# EAGLE design Zio Line Finder (EAGLE 8.6.1)
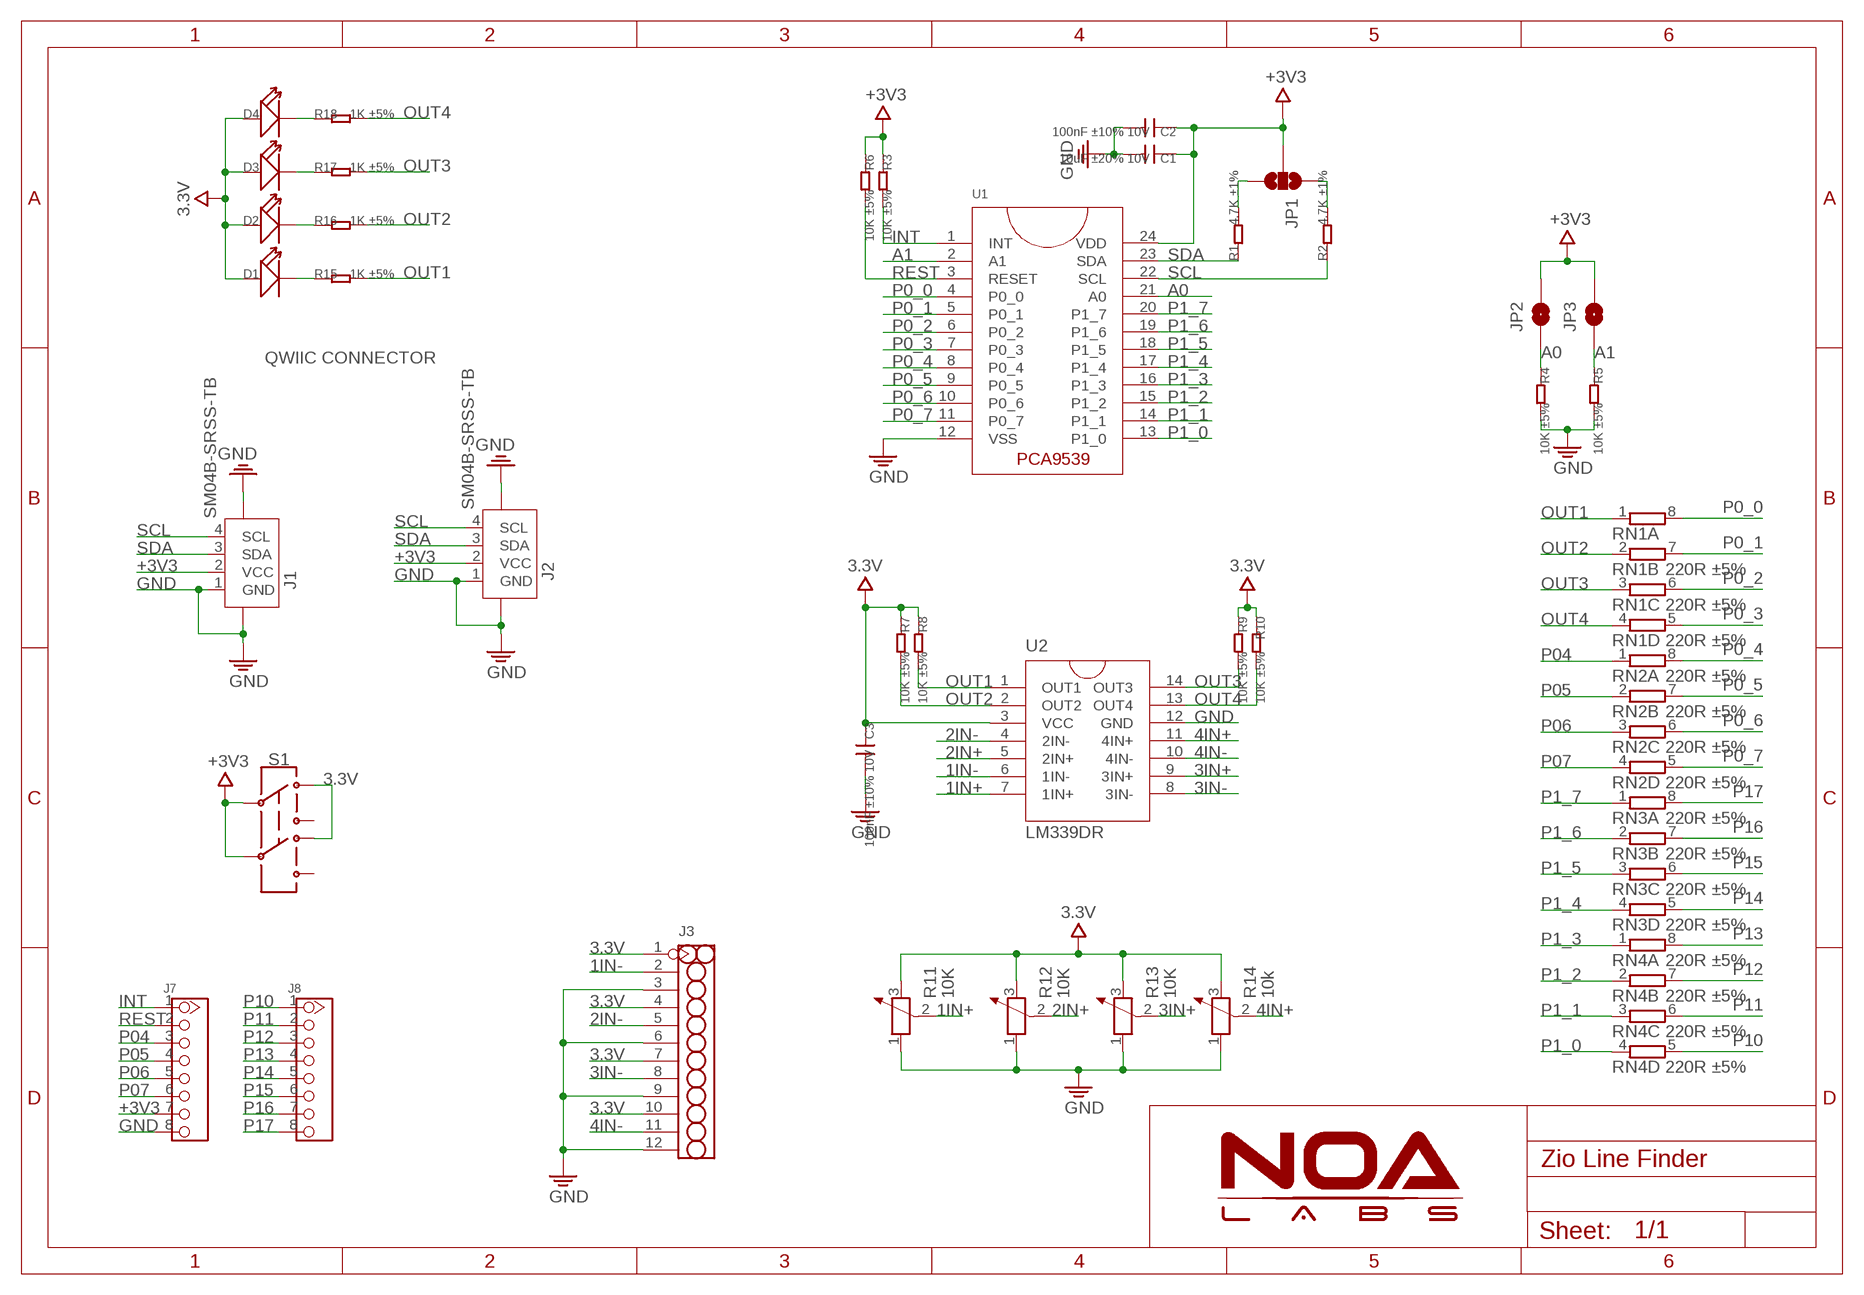
[diagram p0: schematic, sheet 1]

## Parts
C1  10uF ±20% 10V  C-0603  [0603]
C2  100nF ±10% 10V  C-0603  [0603]
C3  100nF ±10% 10V  C-0603  [0603]
D1  LED'0603'  [LED-0603]
D2  LED'0603'  [LED-0603]
D3  LED'0603'  [LED-0603]
D4  LED'0603'  [LED-0603]
J1  SM04B-SRSS-TB  JST-SH-4P-1.0  [JST-SH-4P]
J2  SM04B-SRSS-TB  JST-SH-4P-1.0  [JST-SH-4P]
J3  HEADER-12P-2.54  [12P-2.54]
J7  HEADER-8P-60/35MIL  [8P-2.54-60/35MIL]
J8  HEADER-8P-60/35MIL  [8P-2.54-60/35MIL]
JP1  JUMPER-SMT_3_2-NC_PASTE_NOCREM  [SMT-JUMPER_3_2-NC_PASTE_SILK_NOCREM]
JP2  JUMPER-SMT_2_NC_PASTE_NOCREM  [SMT-JUMPER_2_NC_PASTE_SILK_NOCREM]
JP3  JUMPER-SMT_2_NC_PASTE_NOCREM  [SMT-JUMPER_2_NC_PASTE_SILK_NOCREM]
R1  4.7K ±1%  R-0402  [0402]
R2  4.7K ±1%  R-0402  [0402]
R3  10K ±5%  R-0402  [0402]
R4  10K ±5%  R-0402  [0402]
R5  10K ±5%  R-0402  [0402]
R6  10K ±5%  R-0402  [0402]
R7  10K ±5%  R-0402  [0402]
R8  10K ±5%  R-0402  [0402]
R9  10K ±5%  R-0402  [0402]
R10  10K ±5%  R-0402  [0402]
R11  10K  R-POTENTIOMETER'3362'  [3P-SQUA-7X6.8]
R12  10K  R-POTENTIOMETER'3362'  [3P-SQUA-7X6.8]
R13  10K  R-POTENTIOMETER'3362'  [3P-SQUA-7X6.8]
R14  10k  R-POTENTIOMETER'3362'  [3P-SQUA-7X6.8]
R15  1K ±5%  R-0402  [0402]
R16  1K ±5%  R-0402  [0402]
R17  1K ±5%  R-0402  [0402]
R18  1K ±5%  R-0402  [0402]
RN1  220R ±5%  RESISTOR-DIL_4R-N0603-ARV  [RESISTOR-DIL_0603-ARV]
RN2  220R ±5%  RESISTOR-DIL_4R-N0603-ARV  [RESISTOR-DIL_0603-ARV]
RN3  220R ±5%  RESISTOR-DIL_4R-N0603-ARV  [RESISTOR-DIL_0603-ARV]
RN4  220R ±5%  RESISTOR-DIL_4R-N0603-ARV  [RESISTOR-DIL_0603-ARV]
S1  SWITCH-DPDT-SMD-AYZ0202  [SWITCH_DPDT_SMD_AYZ0202]
U1  PCA9539  [TSSOP24]
U2  LM339DR  LM339  [SOIC14-8.7]

## Nets
1IN+: R11.2 U2.7(1IN+)
1IN-: J3.2 U2.6(1IN-)
2IN+: R12.2 U2.5(2IN+)
2IN-: J3.5 U2.4(2IN-)
3.3V: C3.1 D1.+ D2.+ D3.+ D4.+ J3.1 J3.4 J3.7 J3.10 R7.1 R8.1 R9.1 R10.1 R11.3 R12.3 R13.3 R14.3 S1.1 S1.4 U2.3(VCC)
3IN+: R13.2 U2.9(3IN+)
3IN-: J3.8 U2.8(3IN-)
4IN+: R14.2 U2.11(4IN+)
4IN-: J3.11 U2.10(4IN-)
+3V3: C1.1 C2.1 J1.2(VCC) J2.2(VCC) J7.7 JP1.2 JP2.2 JP3.2 R3.1 R6.1 S1.2 S1.5 U1.24(VDD)
A0: JP2.1 R4.1 U1.21(A0)
A1: JP3.1 R5.1 U1.2(A1)
GND: C1.2 C2.2 C3.2 J1.1(GND) J1.NC1 J1.NC2 J2.1(GND) J2.NC1 J2.NC2 J3.3 J3.6 J3.9 J3.12 J7.8 R4.2 R5.2 R11.1 R12.1 R13.1 R14.1 U1.12(VSS) U2.12(GND)
INT: J7.1 R3.2 U1.1(INT)
N$5: D1.- R15.1
N$6: D2.- R16.1
N$7: D3.- R17.1
N$8: D4.- R18.1
N$9: JP1.3 R1.2
N$10: JP1.1 R2.2
OUT1: R8.2 R15.2 RN1.1 U2.1(OUT1)
OUT2: R7.2 R16.2 RN1.2 U2.2(OUT2)
OUT3: R9.2 R17.2 RN1.3 U2.14(OUT3)
OUT4: R10.2 R18.2 RN1.4 U2.13(OUT4)
P0_0: RN1.8 U1.4(P0_0)
P0_1: RN1.7 U1.5(P0_1)
P0_2: RN1.6 U1.6(P0_2)
P0_3: RN1.5 U1.7(P0_3)
P0_4: RN2.8 U1.8(P0_4)
P0_5: RN2.7 U1.9(P0_5)
P0_6: RN2.6 U1.10(P0_6)
P0_7: RN2.5 U1.11(P0_7)
P1_0: RN4.4 U1.13(P1_0)
P1_1: RN4.3 U1.14(P1_1)
P1_2: RN4.2 U1.15(P1_2)
P1_3: RN4.1 U1.16(P1_3)
P1_4: RN3.4 U1.17(P1_4)
P1_5: RN3.3 U1.18(P1_5)
P1_6: RN3.2 U1.19(P1_6)
P1_7: RN3.1 U1.20(P1_7)
P04: J7.3 RN2.1
P05: J7.4 RN2.2
P06: J7.5 RN2.3
P07: J7.6 RN2.4
P10: J8.1 RN4.5
P11: J8.2 RN4.6
P12: J8.3 RN4.7
P13: J8.4 RN4.8
P14: J8.5 RN3.5
P15: J8.6 RN3.6
P16: J8.7 RN3.7
P17: J8.8 RN3.8
REST: J7.2 R6.2 U1.3(RESET)
SCL: J1.4(SCL) J2.4(SCL) R2.1 U1.22(SCL)
SDA: J1.3(SDA) J2.3(SDA) R1.1 U1.23(SDA)
Unconnected: S1.3 S1.6

## Notes on the sheet
- QWIIC CONNECTOR

## Library data of the parts
C1-C3 = Discretex:C*: Ceramic Capacitors
D1-D4 = Discrete:LED*
J1 J2 = Connector:JST-SH-4P
J3 = Connector:HEADER-12P
J7 J8 = Connector:HEADER-8P
JP1 = NOA-Jumpers:JUMPER-SMT_3_2-NC_PASTE_NOCREM
JP2 JP3 = NOA-Jumpers:JUMPER-SMT_2_NC_PASTE_NOCREM
R1 R2 = Discretex:R*
R3-R10 R15-R18 = Discrete:R*
R11-R14 = Discrete:R-POTENTIOMETER*: Potentiometer
RN1-RN4 = A:RESISTOR-DIL_4R-N: Array Chip Resistor Source: RS Component / Phycomp
S1 = SparkFun-Switches:SWITCH-DPDT: Double-Pole, Double-Throw (DPDT) Switch Double-pole, double-throw switches. Variant Overview PTH-GPI-152-3013 Used on SparkFun Geiger Counter <https://www.sparkfun.com/products/11345> SMD-AY0202 Surface Mount DPDT Switch <https://www.sparkfun.com/products/597> (COM-00597) Used on e.g. LilyPad Arduino USB - ATmega32U4 Board <https://www.sparkfun.com/products/12049>; DIGIKEY: https://www.digikey.com/product-detail/en/c-k/AYZ0202AGRLC/401-2013-1-ND/1640122; PROD_ID: SWCH-08179; SF_SKU: COM-00597
U1 = i2c-led-controller:PCA9539
U2 = IC:LM339

## Board
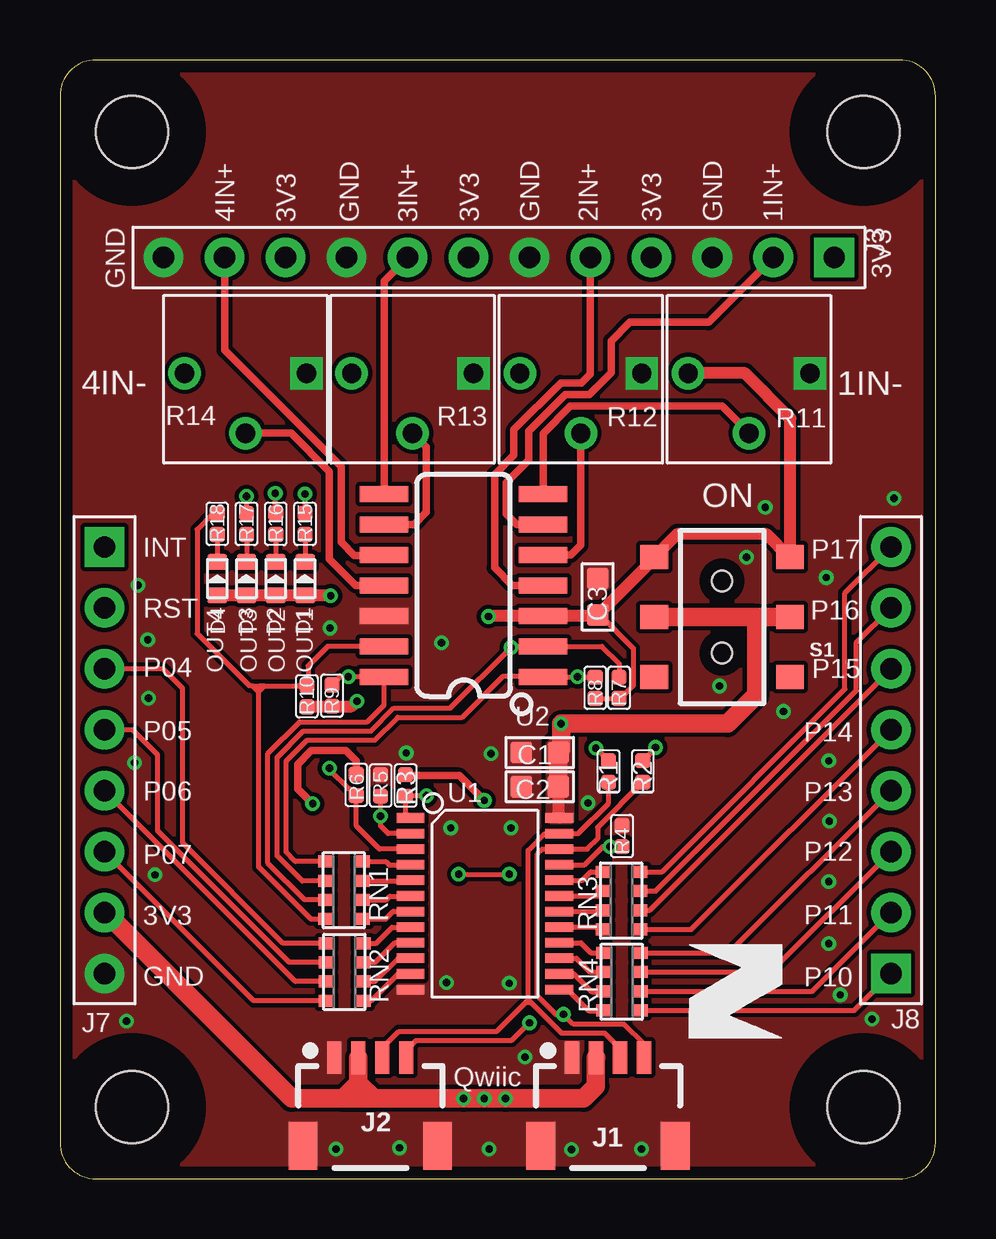
[diagram p1: board, top side]
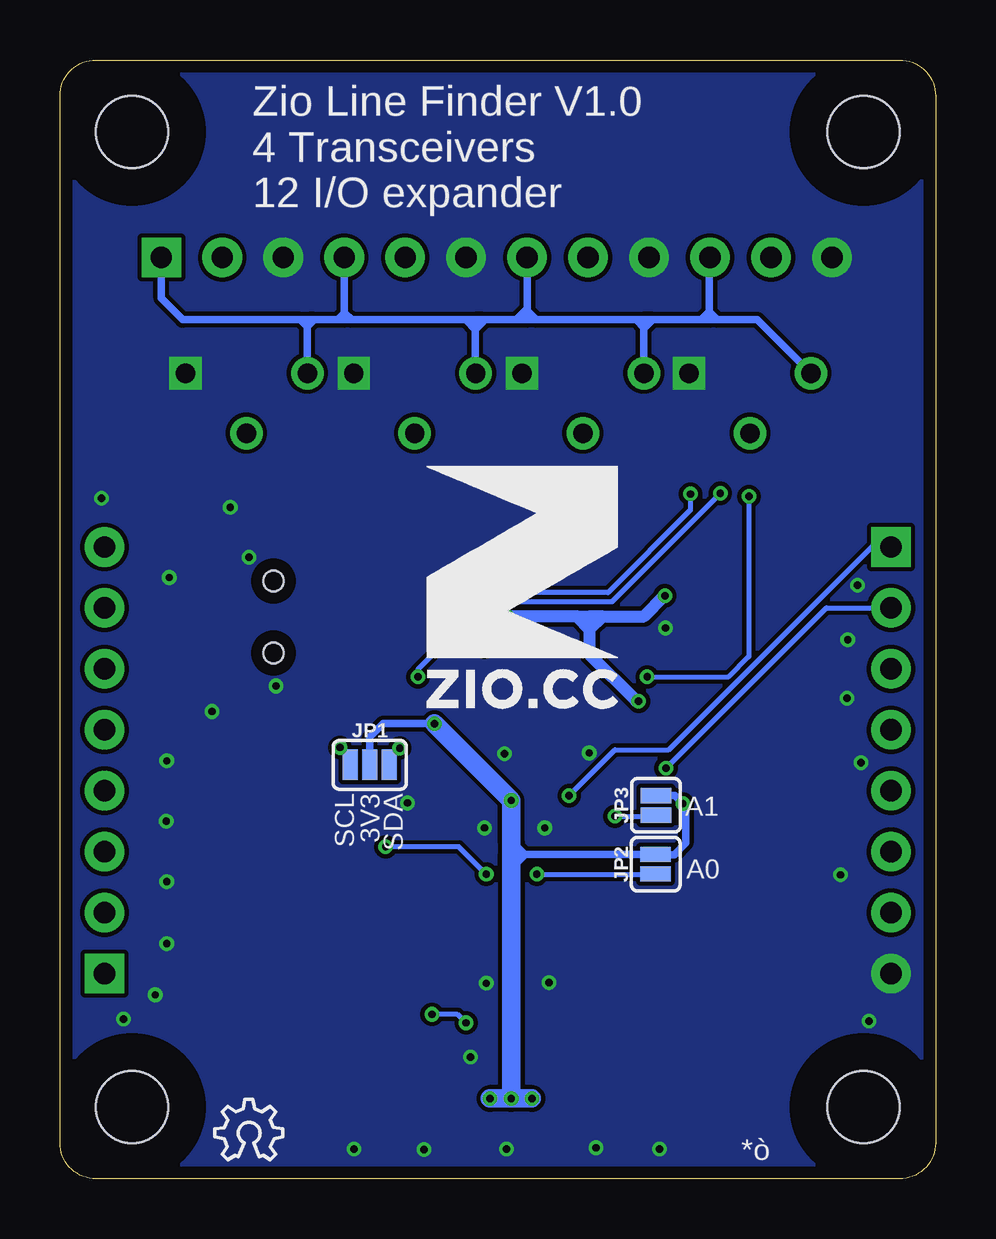
[diagram p2: board, bottom side, seen from below]

Size 36.48 x 46.64 mm. Coordinates in mm from the lower left corner, seen from the top.
Outline: 0,45.14 0,1.5 arc90 1.5,0 34.98,0 arc90 36.48,1.5 36.48,45.14 arc90 34.98,46.64 1.5,46.64 arc90 0,45.14
Copper layers (1*16): Top 0.035mm / dielectric 1.5mm / Bottom 0.035mm
Design rules "NOA Eagle Rule": minimum track width 7mil, minimum drill 12mil, track to track 7mil, track to pad 7mil, pad to pad 7mil, via to via 7mil, smd to smd 0mil, copper to edge 20mil, drill to drill 10mil, minimum pad ring 10mil, minimum via ring 6mil, stop-mask expansion 2mil, vias tented up to drill 25mil, thermal gap 10mil
Holes 3 mm at 3,3 33.48,3 33.48,43.64 3,43.64
tRestrict: area 0,40.6 to 6,46.6; area 0,40.6 to 6,46.6; area 30.5,40.6 to 36.5,46.6; area 0,0 to 6,6; area 30.5,0 to 36.5,6
bRestrict: area 0,40.6 to 6,46.6; area 30.5,40.6 to 36.5,46.6; area 0,0 to 6,6; area 30.5,0 to 36.5,6

### Footprints (pad centres in the part's own frame; a part is rotated, then mirrored left to right if it is on the bottom)
0603 = smd 0.889 x 0.889: 1 -0.762,0; 2 0.762,0
LED-0603 = smd 0.635 x 0.8: + 0.699,0; - -0.699,0
JST-SH-4P = smd 0.6 x 1.35: 1 1.5,0; 2 0.5,0; 3 -0.5,0; 4 -1.5,0 | smd 1.2 x 2: NC1 -2.8,3.675; NC2 2.8,3.675
12P-2.54 = drill 0.889 pad 1.651 square: 1 0,13.97 | drill 0.889 pad 1.651: 2 0,11.43; 3 0,8.89; 4 0,6.35; 5 0,3.81; 6 0,1.27; 7 0,-1.27; 8 0,-3.81; 9 0,-6.35; 10 0,-8.89; 11 0,-11.43; 12 0,-13.97
8P-2.54-60/35MIL = drill 0.889 pad 1.651 square: 1 0,8.89 | drill 0.889 pad 1.651: 2 0,6.35; 3 0,3.81; 4 0,1.27; 5 0,-1.27; 6 0,-3.81; 7 0,-6.35; 8 0,-8.89
SMT-JUMPER_3_2-NC_PASTE_SILK_NOCREM = smd 0.635 x 1.27: 1 -0.813,0; 2 0,0; 3 0.813,0
SMT-JUMPER_2_NC_PASTE_SILK_NOCREM = smd 0.635 x 1.27: 1 -0.406,0; 2 0.406,0
0402 = smd 0.635 x 0.635: 1 -0.445,0; 2 0.445,0
3P-SQUA-7X6.8 = drill 0.8 pad 1.35 square: 1 -2.54,-0.25 | drill 0.8 pad 1.35: 2 0,2.25; 3 2.54,-0.25
RESISTOR-DIL_0603-ARV = smd 0.5 x 0.65: 1 -1.2,-0.752; 2 -0.4,-0.752; 3 0.4,-0.752; 4 1.2,-0.752; 5 1.2,0.752; 6 0.4,0.752; 7 -0.4,0.752; 8 -1.2,0.752
SWITCH_DPDT_SMD_AYZ0202 = smd 1 x 1.15: 1 -2.5,2.825; 2 0,2.825; 3 2.5,2.825; 4 -2.5,-2.825; 5 0,-2.825; 6 2.5,-2.825 | hole 0.85: 1.5,0; -1.5,0
TSSOP24 = smd 0.4 x 1.15: 1 -3.575,-3.1; 2 -2.925,-3.1; 3 -2.275,-3.1; 4 -1.625,-3.1; 5 -0.975,-3.1; 6 -0.325,-3.1; 7 0.325,-3.1; 8 0.975,-3.1; 9 1.625,-3.1; 10 2.275,-3.1; 11 2.925,-3.1; 12 3.575,-3.1; 13 3.575,3.1; 14 2.925,3.1; 15 2.275,3.1; 16 1.625,3.1; 17 0.975,3.1; 18 0.325,3.1; 19 -0.325,3.1; 20 -0.975,3.1; 21 -1.625,3.1; 22 -2.275,3.1; 23 -2.925,3.1; 24 -3.575,3.1
SOIC14-8.7 = smd 0.66 x 2.032: 1 -3.81,-3.315; 2 -2.54,-3.315; 3 -1.27,-3.315; 4 0,-3.315; 5 1.27,-3.315; 6 2.54,-3.315; 7 3.81,-3.315; 8 3.81,3.315; 9 2.54,3.315; 10 1.27,3.315; 11 0,3.315; 12 -1.27,3.315; 13 -2.54,3.315; 14 -3.81,3.315

### Placement (x,y rotation side)
C1  19.99,17.77 180 top
C2  19.99,16.35 180 top
C3  22.4,24.26 90 top
D1  10.21,25.02 270 top
D2  8.99,25.02 270 top
D3  7.77,25.02 270 top
D4  6.55,25.02 270 top
J1  22.83,5.05 180 top
J2  12.93,5.05 180 top
J3  18.29,38.4 270 top
J7  1.85,17.45 0 top
J8  34.63,17.45 180 top
JP1  23.57,17.26 0 bottom
JP2  11.66,13.12 90 bottom
JP3  11.65,15.57 90 bottom
R1  22.86,16.98 90 top
R2  24.28,16.98 90 top
R3  14.4,16.4 270 top
R4  23.42,14.29 90 top
R5  13.36,16.4 90 top
R6  12.34,16.42 270 top
R7  23.29,20.47 90 top
R8  22.3,20.47 90 top
R9  11.33,20.14 90 top
R10  10.29,20.12 90 top
R11  28.71,33.33 180 top
R12  21.7,33.33 180 top
R13  14.69,33.33 180 top
R14  7.73,33.33 180 top
R15  10.21,27.3 90 top
R16  8.99,27.3 90 top
R17  7.77,27.3 90 top
R18  6.55,27.3 90 top
RN1  11.84,12.03 270 top
RN2  11.86,8.63 270 top
RN3  23.39,11.6 270 top
RN4  23.42,8.22 270 top
S1  27.58,23.42 270 top
U1  17.7,11.47 270 top
U2  16.81,24.74 90 top
U$6  [10MM]  21.21,19.63 0 bottom
U$7  [OSHW_6X100_NOTEXT]  30.02,0.79 0 bottom
U$8  [6MM]  26.19,5.84 0 top

### Tracks (layer width: path | path; a pad name or v marks a point on that pad's centre or on a via)
1IN+
  Top 0.305: U2.7 20.13,31.08 21.26,32.21 27.59,32.21 R11.2
1IN-
  Top 0.305: U2.6 19.03,27.28 18.59,27.71 18.59,29.03 19.53,29.97 19.53,31.16 21.06,32.69 22.05,32.69 22.96,33.6 22.96,34.92 23.75,35.71 27.03,35.71 J3.2
2IN+
  Top 0.305: U2.5 21.28,26.01 21.69,26.42 21.69,31.07 R12.2
2IN-
  Top 0.305: U2.4 18.85,24.74 18.11,25.48 18.11,29.36 18.91,30.17 18.91,31.23 20.86,33.17 21.72,33.17 22.1,33.55 J3.5
3.3V  (via drill 0.3)
  Top 0.203: R8.1 R7.1 23.49,20.03 23.49,20.18 23.89,20.58 23.89,22.11 22.5,23.49
  Top 0.305: 23.33,19.99 R7.1 | 22.5,23.49 C3.1
  Top 0.508: v17.86,23.44 17.88,23.47 U2.3 22.38,23.47 C3.1 24.76,25.85 S1.4 25.71,26.87 29.44,26.87 30.39,25.92 S1.1 30.43,25.94 30.43,31.7 28.55,33.58 R11.3 | v11.28,24.31 D1.+ D2.+ D3.+ D4.+ | R10.1 10.31,19.7 R9.1 12.15,19.7 v12.37,19.91
  Bottom 0.305: R14.3 7.42,35.81 9.09,35.81 | 9.09,35.81 9.42,35.81 | 9.63,35.81 9.42,35.81 | 9.75,35.81 9.63,35.81 | 11.79,35.81 12.19,35.81 | 11.79,35.81 9.75,35.81 | 12.47,35.81 12.19,35.81 | 16.64,35.81 17.04,35.81 | 16.64,35.81 12.47,35.81 | 17.48,35.81 17.04,35.81 | 18.87,35.81 19.18,35.81 | 18.87,35.81 17.48,35.81 | 19.58,35.81 19.18,35.81 | 24.33,35.81 24.64,35.81 | 24.33,35.81 19.58,35.81 | 24.92,35.81 24.64,35.81 | 25.88,35.81 26.09,35.81 | 25.88,35.81 24.92,35.81 | 26.47,35.81 26.09,35.81 | 26.47,35.81 31.37,35.81 32.26,36.7 J3.1 | J3.10 9.42,38.38 9.42,36.02 9.63,35.81 | 9.42,36.14 9.42,35.81 | 9.42,36.14 9.09,35.81 | 9.42,36.14 9.75,35.81 | R13.3 12.15,35.45 | 12.15,35.49 12.15,35.77 12.19,35.81 | 12.15,35.45 11.79,35.81 | 12.15,35.45 12.15,35.49 | 12.15,35.49 12.47,35.81 | J3.7 17.02,36.27 | 17.02,36.19 17.02,35.84 17.04,35.81 | 17.02,36.27 17.02,36.19 | 17.02,36.19 16.64,35.81 | 17.02,36.27 17.48,35.81 | R12.3 19.18,33.6 19.18,35.41 | 19.18,35.41 19.18,35.81 | 19.18,35.41 18.87,35.71 18.87,35.81 | 19.18,35.41 19.58,35.81 | J3.4 24.64,36.12 | 24.64,36.09 24.64,35.81 | 24.64,36.12 24.33,35.81 | 24.64,36.12 24.64,36.09 | 24.64,36.09 24.92,35.81 | R11.3 26.17,35.52 | 26.17,35.53 26.17,35.73 26.09,35.81 | 26.17,35.52 26.17,35.53 | 26.17,35.53 25.88,35.81 | 26.17,35.52 26.47,35.81
  Bottom 0.508: 14.94,23.44 14.43,23.44 | 14.94,23.44 v17.86,23.44 | 13.89,23.44 14.43,23.44 | 13.89,23.44 12.14,23.44 v11.28,24.31 | v12.37,19.91 12.47,19.91 14.4,21.84 14.4,22.91 | 14.4,22.94 14.4,23.42 14.43,23.44 | 14.4,22.91 14.4,22.94 | 14.4,22.94 13.89,23.44 | 14.4,22.91 14.94,23.44
3IN+
  Top 0.305: U2.9 14.76,27.28 15.27,27.79 15.27,30.51 R13.2
3IN-
  Top 0.305: U2.8 13.5,37.43 J3.8
4IN+
  Top 0.305: U2.11 12.32,24.74 11.23,25.83 11.23,29.49 9.64,31.08 R14.2
4IN-
  Top 0.305: J3.11 6.86,34.54 11.71,29.69 11.71,26.54 12.27,25.98 13.48,25.98 U2.10
+3V3  (via drill 0.3)
  Top 0.305: R3.1 14.43,16.81 16.64,16.81 v17.68,15.77 | R6.1 12.34,17.42 11.91,17.86 10.48,17.86 9.9,17.28 9.9,16.26 v10.53,15.63
  Top 0.508: C2.1 20.75,15.1 U1.24
  Top 0.762: 28.96,23.42 S1.5 | 28.96,23.42 S1.2 | J7.7 1.9,11.1 9.65,3.35 11.79,3.35 | 11.79,3.35 12.6,3.35 | 12.6,3.35 13.06,3.35 | J1.2 22.33,3.86 21.82,3.35 v18.57,3.35 v16.81,3.35 13.06,3.35 | J2.2 12.43,3.99 | 12.43,3.99 12.43,3.52 12.6,3.35 | 12.43,3.99 11.79,3.35 | 12.43,3.99 13.06,3.35 | 28.96,23.42 29.01,23.37 29.01,20.17 27.81,18.97 v20.88,18.97 20.88,17.9 C1.1 C2.1
  Bottom 0.305: v20.88,18.97 23.01,18.97 23.57,18.41 JP1.2 | 17.09,13.53 JP2.2 11.69,13.51 10.9,13.51 10.41,14 10.41,15.52 v10.53,15.63 10.87,15.98 JP3.2 | 17.11,13.53 17.61,13.53 17.68,13.46 | 17.09,13.53 17.11,13.53 | 17.11,13.53 17.68,14.1 | 17.09,13.53 17.68,12.94 17.68,12.75
  Bottom 0.762: v17.68,3.35 17.68,12.75 17.68,13.46 17.68,14.1 v17.68,15.77 v20.88,18.97 | v16.81,3.35 v17.68,3.35 | v17.68,3.35 v18.57,3.35
  pour Top (no thermals): 21.34,14.91 21.34,18.24 21.21,18.36 20.57,18.36 20.32,18.11 20.32,15.01 20.42,14.91
A0  (via drill 0.3)
  Top 0.203: U1.21 21.86,13.1 22.61,13.84 v22.91,13.84 R4.1 | v16.61,12.7 v18.72,12.7
  Bottom 0.203: JP2.1 11.73,12.7 v16.61,12.7 | v18.72,12.7 19.86,13.84 v22.91,13.84
A1  (via drill 0.3)
  Top 0.203: U1.2 13.67,14.4 13.36,14.71 v13.36,15.11 R5.1
  Bottom 0.203: JP3.1 11.7,15.11 v13.36,15.11
GND  (via drill 0.3)
  Top 0.305: J2.1 11.51,5.13
  other vias: 2.77,6.58 32.03,17.42 32.05,14.91 32.03,12.4 32.03,9.8 32.51,7.67 33.83,6.65 30.15,19.48 27.48,20.55 31.93,25.07 34.75,28.37 28.6,25.91 29.39,27.99 3.25,24.74 3.66,22.48 3.68,20.04 3.1,17.35 3.96,12.67 17.88,1.24 11.51,1.24 14.15,1.3 21.31,1.22 24.23,1.24 19.38,5.08 16.1,8.18 18.72,8.15 16.28,14.63 18.8,14.63 22,15.67 14.43,17.75 17.96,17.73 15.9,22.35 11.25,22.96
  pour Top (rank 2, no thermals): 0,46.66 0,0 36.47,0 36.47,46.66
  pour Bottom (rank 2, no thermals): 0.03,46.69 0.03,0 36.5,0 36.5,46.69
INT  (via drill 0.3)
  Top 0.203: U1.1 14.4,15.25 R3.2 14.42,15.98 v15.27,15.98
  Bottom 0.203: v15.27,15.98 13.36,17.88 11.13,17.88 2.67,26.34 J7.1
N$5
  Top 0.203: R15.1 D1.-
N$6
  Top 0.203: R16.1 D2.-
N$7
  Top 0.203: R17.1 D3.-
N$8
  Top 0.203: R18.1 D4.-
N$9  (via drill 0.3)
  Top 0.203: R1.2 v22.33,17.96
  Bottom 0.203: JP1.3 22.76,17.53 v22.33,17.96
N$10  (via drill 0.3)
  Top 0.203: v24.82,17.98 24.82,17.96 R2.2
  Bottom 0.203: JP1.1 24.38,17.53 24.82,17.96 v24.82,17.98
OUT1  (via drill 0.3)
  Top 0.203: R8.2 22.29,20.93 v21.56,20.93 U2.1 20.1,20.95 18.47,20.95 16.75,19.24 14.07,19.24 13.12,18.29 10.3,18.29 9.42,17.41 9.42,13.62 9.81,13.23 RN1.1 | R15.2 v10.21,28.55
  Bottom 0.203: v10.21,28.55 10.21,27.87 13.65,24.43 18.37,24.43 19.38,23.42 21.56,21.23 v21.56,20.93
OUT2  (via drill 0.3)
  Top 0.203: RN1.2 11.07,12.42 10.08,12.42 9.04,13.46 9.04,17.57 10.14,18.67 12.96,18.67 13.91,19.62 16.27,19.62 v18.8,22.15 18.85,22.2 U2.2 22.58,22.2 23.29,21.49 R7.2 | R16.2 8.97,27.77 v8.97,28.57
  Bottom 0.203: v8.97,28.57 13.49,24.05 18.21,24.05 18.8,23.47 v18.8,22.15
OUT3  (via drill 0.3)
  Top 0.203: RN1.3 10.19,11.63 8.66,13.16 8.66,17.73 9.98,19.05 12.8,19.05 13.5,19.75 U2.14 v12.01,20.93 11.67,20.93 R9.2 | R17.2 v7.77,28.45
  Bottom 0.203: v7.77,28.45 7.77,21.77 8.62,20.93 v12.01,20.93
OUT4
  Top 0.203: 10.19,20.57 9.96,20.57 | 10.19,20.57 10.27,20.57 R10.2 10.34,20.61 10.34,21.39 11.15,22.2 U2.13 | RN1.4 10.45,10.83 8.28,13 8.28,20.27 | R18.2 6.39,27.75 5.71,27.08 5.71,22.73 7.9,20.55 8.03,20.55 | 8.03,20.55 8.33,20.55 | 8.51,20.55 8.33,20.55 | 8.51,20.55 10.16,20.55 10.19,20.57 | 8.33,20.55 8.28,20.5 8.28,20.27 | 8.28,20.27 8.28,20.29 8.03,20.55 | 8.28,20.27 8.28,20.32 8.51,20.55
P0_0
  Top 0.203: RN1.8 13.57,13.23 13.72,13.08 14.59,13.08 U1.4
P0_1
  Top 0.203: RN1.7 14.59,12.43 U1.5
P0_2
  Top 0.203: RN1.6 13.59,11.63 13.74,11.79 14.59,11.79 U1.6
P0_3
  Top 0.203: RN1.5 13.57,10.83 13.89,11.15 U1.7
P0_4
  Top 0.203: RN2.8 13.18,9.83 13.84,10.49 U1.8
P0_5
  Top 0.203: RN2.7 13.14,9.03 13.97,9.86 14.59,9.86 U1.9
P0_6
  Top 0.203: RN2.6 13.11,8.23 14.08,9.2 U1.10
P0_7
  Top 0.203: RN2.5 12.96,7.43 14.08,8.55 U1.11
P1_0
  Top 0.203: U1.13 21.14,7.9 22.02,7.01 22.66,7.01 RN4.4
P1_1
  Top 0.203: U1.14 21.4,8.55 22.15,7.8 22.64,7.8 RN4.3
P1_2
  Top 0.203: U1.15 21.51,9.2 22.07,8.64 22.65,8.64 RN4.2
P1_3
  Top 0.203: U1.16 21.7,9.85 22.12,9.42 RN4.1
P1_4
  Top 0.203: U1.17 22.54,10.5 RN3.4
P1_5
  Top 0.203: U1.18 22.59,11.15 RN3.3
P1_6
  Top 0.203: U1.19 22.44,11.8 RN3.2
P1_7
  Top 0.203: U1.20 21.77,12.45 22.12,12.8 RN3.1
P04
  Top 0.203: J7.3 4.29,21.26 5.11,20.45 5.11,14.01 9.28,9.83 RN2.1
P05
  Top 0.203: J7.4 3.02,18.72 4.06,17.68 4.06,14.51 9.55,9.03 RN2.2
P06
  Top 0.203: RN2.3 9.81,8.23 J7.5
P07
  Top 0.203: RN2.4 8.07,7.43 J7.6
P10
  Top 0.203: RN4.5 33.09,7.02 J8.1
P11
  Top 0.203: RN4.6 31.35,7.82 J8.2
P12
  Top 0.203: RN4.7 29.61,8.62 J8.3
P13
  Top 0.203: RN4.8 27.87,9.42 J8.4
P14
  Top 0.203: RN3.5 26.3,10.4 J8.5
P15
  Top 0.203: RN3.6 24.56,11.2 J8.6
P16
  Top 0.203: RN3.7 24.83,12 33.19,20.36 33.19,22.36 J8.7
P17
  Top 0.203: RN3.8 25.09,12.8 32.7,20.41 32.7,24.41 J8.8
REST  (via drill 0.3)
  Top 0.203: U1.3 13.3,13.75 12.34,14.71 R6.2 12.05,16.27 12,16.27 11.23,17.05 v11.23,17.12
  Bottom 0.203: v11.23,17.12 4.55,23.8 J7.2
SCL  (via drill 0.3)
  Top 0.203: J1.4 24.33,5.61 23.49,6.45 21.39,6.45 v20.98,6.86 20.65,6.86 19.89,7.62 19.89,13.54 20.09,13.74 U1.22 21.97,13.75 22.4,14.18 22.4,14.66 R2.1 | J2.4 14.43,5.36 14.83,5.77 18.82,5.77 v19.56,6.5
  Bottom 0.203: v19.56,6.5 19.91,6.86 v20.98,6.86
SDA
  Top 0.203: 19.51,7.46 19.51,13.7 20.21,14.4 U1.23 21.6,14.4 22.86,15.66 R1.1 | 19.63,7.34 20.9,6.07 22.69,6.07 23.33,5.42 J1.3 | 19.63,7.34 19.51,7.46 | J2.3 13.43,5.45 14.12,6.15 18.19,6.15 19.37,7.33 | 19.37,7.33 19.51,7.46 | 19.63,7.34 19.38,7.34 19.37,7.33

### Text on the board
tPlace: 4IN+ | 3V3 | GND | 3IN+ | 3V3 | GND | 2IN+ | 3V3 | GND | 1IN+ | 3V3 | GND | 4IN- | 1IN- | ON | P17 | INT | P16 | RST | P15 | P04 | OUT4 | OUT3 | OUT2 | OUT1 | P14 | P05 | P13 | P06 | P12 | P07 | 3V3 | P11 | P10 | GND | Qwiic
bPlace: Zio Line Finder V1.0 / 4 Transceivers / 12 I/O expander | SDA | 3V3 | SCL | A1 | A0 | *ò